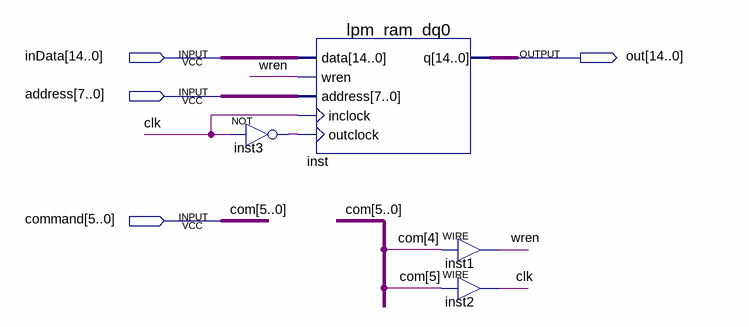
[diagram p0: schematic sheet]
// Quartus schematic RAM.bdf as structural Verilog: 4 symbols, 4 pins
module RAM (
  input  [14:0] inData,
  input  [7:0] address,
  input  [5:0] command,
  output [14:0] out
);

  wire clk, inst3_out, wren;

  lpm_ram_dq0 inst (.data(inData), .wren(wren), .address(address), .inclock(clk), .outclock(inst3_out), .q(out));
  not inst3 (inst3_out, clk);
  assign wren = command[4];  // WIRE inst1
  assign clk = command[5];  // WIRE inst2

  // Other names for the same wires on the sheet: com[5:0] = command
endmodule
